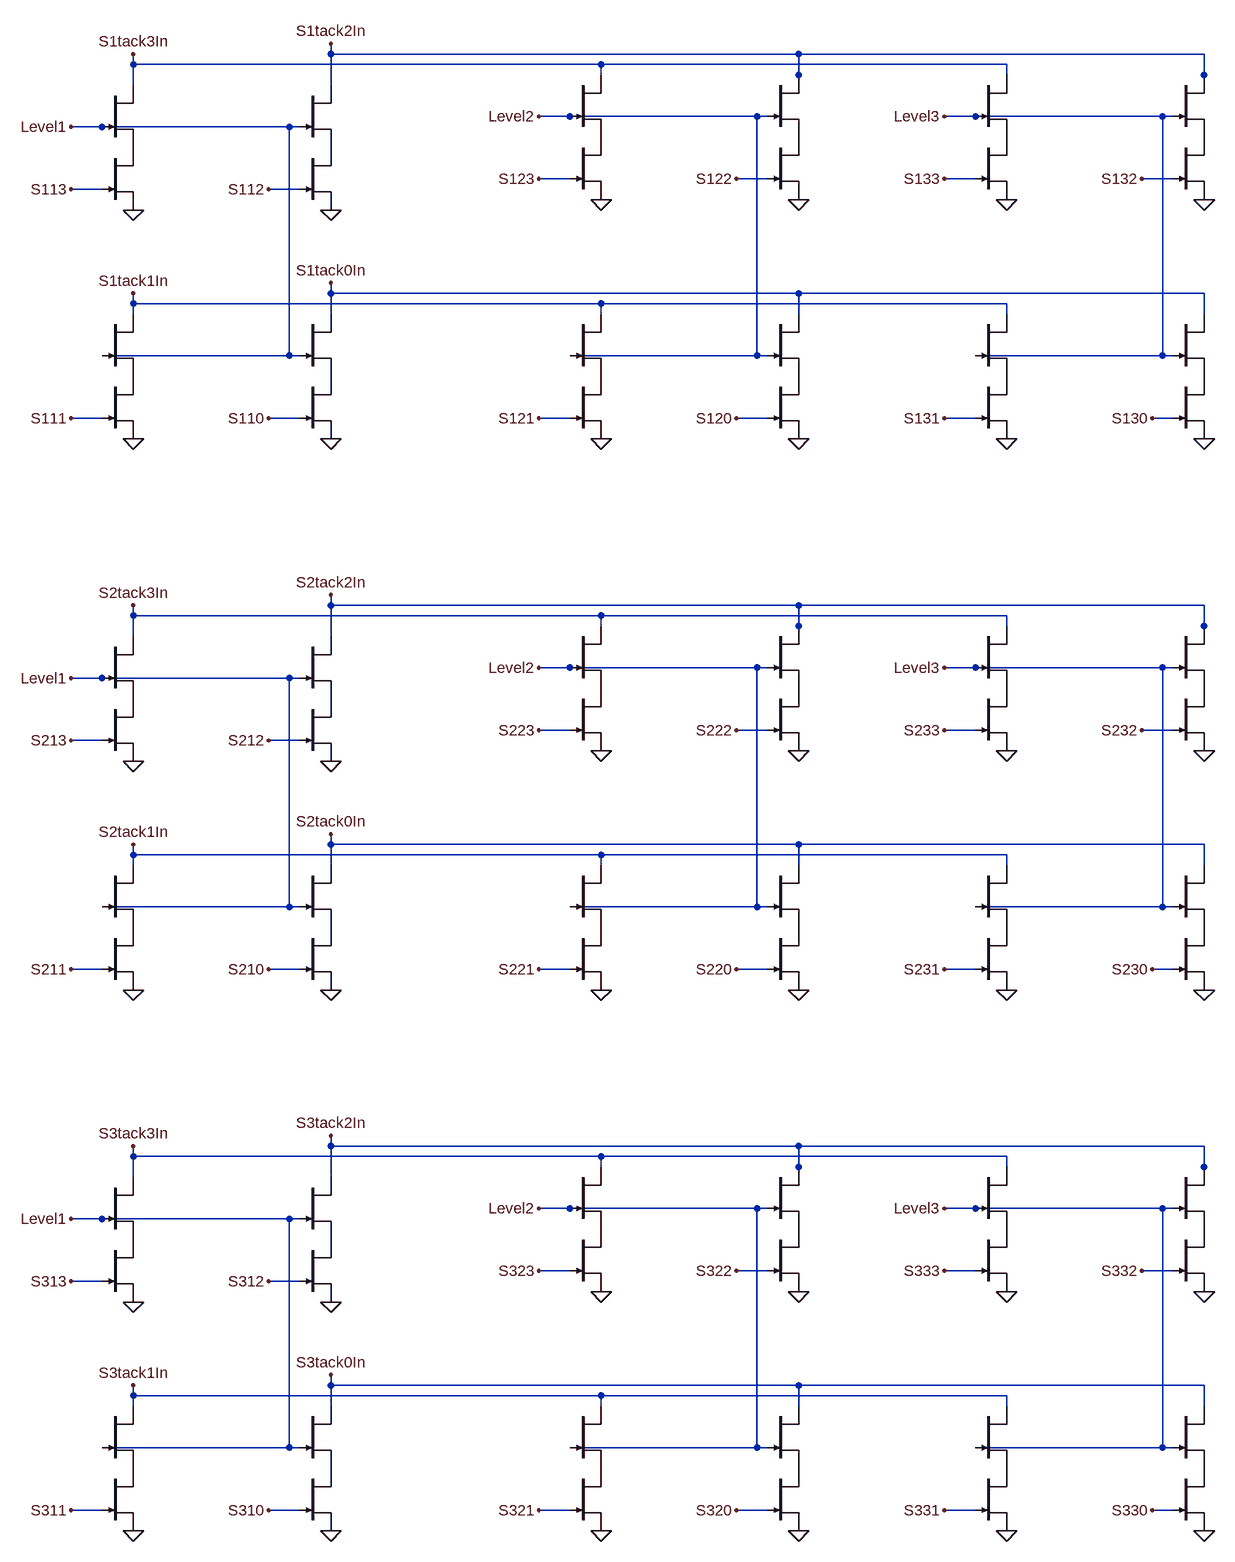
[diagram p0: schematic Bus.asc]
Bus.asc, the LTspice schematic file:
Version 4.1
SHEET 1 109444 42780
WIRE 32592 4992 32592 4976
WIRE 33312 4992 32592 4992
WIRE 33936 4992 33312 4992
WIRE 32288 5008 32288 4992
WIRE 33008 5008 32288 5008
WIRE 33632 5008 33008 5008
WIRE 33008 5024 33008 5008
WIRE 33312 5024 33312 4992
WIRE 33632 5024 33632 5008
WIRE 33936 5024 33936 4992
WIRE 32288 5040 32288 5008
WIRE 32592 5040 32592 4992
WIRE 33312 5040 33312 5024
WIRE 33936 5040 33936 5024
WIRE 32960 5088 32912 5088
WIRE 33248 5088 32960 5088
WIRE 33264 5088 33248 5088
WIRE 33584 5088 33536 5088
WIRE 33872 5088 33584 5088
WIRE 33888 5088 33872 5088
WIRE 32240 5104 32192 5104
WIRE 32528 5104 32240 5104
WIRE 32544 5104 32528 5104
WIRE 32960 5184 32912 5184
WIRE 33264 5184 33216 5184
WIRE 33584 5184 33536 5184
WIRE 33888 5184 33840 5184
WIRE 32240 5200 32192 5200
WIRE 32544 5200 32496 5200
WIRE 32592 5360 32592 5344
WIRE 33312 5360 32592 5360
WIRE 33936 5360 33312 5360
WIRE 32288 5376 32288 5360
WIRE 33008 5376 32288 5376
WIRE 33632 5376 33008 5376
WIRE 32288 5392 32288 5376
WIRE 32592 5392 32592 5360
WIRE 33008 5392 33008 5376
WIRE 33312 5392 33312 5360
WIRE 33632 5392 33632 5376
WIRE 33936 5392 33936 5360
WIRE 32528 5456 32528 5104
WIRE 32528 5456 32240 5456
WIRE 32544 5456 32528 5456
WIRE 33248 5456 33248 5088
WIRE 33248 5456 32960 5456
WIRE 33264 5456 33248 5456
WIRE 33872 5456 33872 5088
WIRE 33872 5456 33584 5456
WIRE 33888 5456 33872 5456
WIRE 32240 5552 32192 5552
WIRE 32544 5552 32496 5552
WIRE 32960 5552 32912 5552
WIRE 33264 5552 33216 5552
WIRE 33584 5552 33536 5552
WIRE 33888 5552 33856 5552
WIRE 32592 5840 32592 5824
WIRE 33312 5840 32592 5840
WIRE 33936 5840 33312 5840
WIRE 32288 5856 32288 5840
WIRE 33008 5856 32288 5856
WIRE 33632 5856 33008 5856
WIRE 33008 5872 33008 5856
WIRE 33312 5872 33312 5840
WIRE 33632 5872 33632 5856
WIRE 33936 5872 33936 5840
WIRE 32288 5888 32288 5856
WIRE 32592 5888 32592 5840
WIRE 33312 5888 33312 5872
WIRE 33936 5888 33936 5872
WIRE 32960 5936 32912 5936
WIRE 33248 5936 32960 5936
WIRE 33264 5936 33248 5936
WIRE 33584 5936 33536 5936
WIRE 33872 5936 33584 5936
WIRE 33888 5936 33872 5936
WIRE 32240 5952 32192 5952
WIRE 32528 5952 32240 5952
WIRE 32544 5952 32528 5952
WIRE 32960 6032 32912 6032
WIRE 33264 6032 33216 6032
WIRE 33584 6032 33536 6032
WIRE 33888 6032 33840 6032
WIRE 32240 6048 32192 6048
WIRE 32544 6048 32496 6048
WIRE 32592 6208 32592 6192
WIRE 33312 6208 32592 6208
WIRE 33936 6208 33312 6208
WIRE 32288 6224 32288 6208
WIRE 33008 6224 32288 6224
WIRE 33632 6224 33008 6224
WIRE 32288 6240 32288 6224
WIRE 32592 6240 32592 6208
WIRE 33008 6240 33008 6224
WIRE 33312 6240 33312 6208
WIRE 33632 6240 33632 6224
WIRE 33936 6240 33936 6208
WIRE 32528 6304 32528 5952
WIRE 32528 6304 32240 6304
WIRE 32544 6304 32528 6304
WIRE 33248 6304 33248 5936
WIRE 33248 6304 32960 6304
WIRE 33264 6304 33248 6304
WIRE 33872 6304 33872 5936
WIRE 33872 6304 33584 6304
WIRE 33888 6304 33872 6304
WIRE 32240 6400 32192 6400
WIRE 32544 6400 32496 6400
WIRE 32960 6400 32912 6400
WIRE 33264 6400 33216 6400
WIRE 33584 6400 33536 6400
WIRE 33888 6400 33856 6400
WIRE 32592 6672 32592 6656
WIRE 33312 6672 32592 6672
WIRE 33936 6672 33312 6672
WIRE 32288 6688 32288 6672
WIRE 33008 6688 32288 6688
WIRE 33632 6688 33008 6688
WIRE 33008 6704 33008 6688
WIRE 33312 6704 33312 6672
WIRE 33632 6704 33632 6688
WIRE 33936 6704 33936 6672
WIRE 32288 6720 32288 6688
WIRE 32592 6720 32592 6672
WIRE 33312 6720 33312 6704
WIRE 33936 6720 33936 6704
WIRE 32960 6768 32912 6768
WIRE 33248 6768 32960 6768
WIRE 33264 6768 33248 6768
WIRE 33584 6768 33536 6768
WIRE 33872 6768 33584 6768
WIRE 33888 6768 33872 6768
WIRE 32240 6784 32192 6784
WIRE 32528 6784 32240 6784
WIRE 32544 6784 32528 6784
WIRE 32960 6864 32912 6864
WIRE 33264 6864 33216 6864
WIRE 33584 6864 33536 6864
WIRE 33888 6864 33840 6864
WIRE 32240 6880 32192 6880
WIRE 32544 6880 32496 6880
WIRE 32592 7040 32592 7024
WIRE 33312 7040 32592 7040
WIRE 33936 7040 33312 7040
WIRE 32288 7056 32288 7040
WIRE 33008 7056 32288 7056
WIRE 33632 7056 33008 7056
WIRE 32288 7072 32288 7056
WIRE 32592 7072 32592 7040
WIRE 33008 7072 33008 7056
WIRE 33312 7072 33312 7040
WIRE 33632 7072 33632 7056
WIRE 33936 7072 33936 7040
WIRE 32528 7136 32528 6784
WIRE 32528 7136 32240 7136
WIRE 32544 7136 32528 7136
WIRE 33248 7136 33248 6768
WIRE 33248 7136 32960 7136
WIRE 33264 7136 33248 7136
WIRE 33872 7136 33872 6768
WIRE 33872 7136 33584 7136
WIRE 33888 7136 33872 7136
WIRE 32240 7232 32192 7232
WIRE 32544 7232 32496 7232
WIRE 32960 7232 32912 7232
WIRE 33264 7232 33216 7232
WIRE 33584 7232 33536 7232
WIRE 33888 7232 33856 7232
FLAG 32288 5232 0
FLAG 32192 5104 Level1
FLAG 32592 5232 0
FLAG 32288 5584 0
FLAG 32592 5584 0
FLAG 33008 5216 0
FLAG 32912 5088 Level2
FLAG 33312 5216 0
FLAG 33008 5584 0
FLAG 33312 5584 0
FLAG 33632 5216 0
FLAG 33536 5088 Level3
FLAG 33936 5216 0
FLAG 33632 5584 0
FLAG 33936 5584 0
FLAG 33536 5184 S133
FLAG 33840 5184 S132
FLAG 33536 5552 S131
FLAG 33856 5552 S130
FLAG 32912 5184 S123
FLAG 33216 5184 S122
FLAG 32912 5552 S121
FLAG 33216 5552 S120
FLAG 32192 5200 S113
FLAG 32496 5200 S112
FLAG 32192 5552 S111
FLAG 32496 5552 S110
FLAG 32288 5360 S1tack1In
FLAG 32592 5344 S1tack0In
FLAG 32592 4976 S1tack2In
FLAG 32288 4992 S1tack3In
FLAG 32288 6080 0
FLAG 32192 5952 Level1
FLAG 32592 6080 0
FLAG 32288 6432 0
FLAG 32592 6432 0
FLAG 33008 6064 0
FLAG 32912 5936 Level2
FLAG 33312 6064 0
FLAG 33008 6432 0
FLAG 33312 6432 0
FLAG 33632 6064 0
FLAG 33536 5936 Level3
FLAG 33936 6064 0
FLAG 33632 6432 0
FLAG 33936 6432 0
FLAG 33536 6032 S233
FLAG 33840 6032 S232
FLAG 33536 6400 S231
FLAG 33856 6400 S230
FLAG 32912 6032 S223
FLAG 33216 6032 S222
FLAG 32912 6400 S221
FLAG 33216 6400 S220
FLAG 32192 6048 S213
FLAG 32496 6048 S212
FLAG 32192 6400 S211
FLAG 32496 6400 S210
FLAG 32288 6208 S2tack1In
FLAG 32592 6192 S2tack0In
FLAG 32592 5824 S2tack2In
FLAG 32288 5840 S2tack3In
FLAG 32288 6912 0
FLAG 32192 6784 Level1
FLAG 32592 6912 0
FLAG 32288 7264 0
FLAG 32592 7264 0
FLAG 33008 6896 0
FLAG 32912 6768 Level2
FLAG 33312 6896 0
FLAG 33008 7264 0
FLAG 33312 7264 0
FLAG 33632 6896 0
FLAG 33536 6768 Level3
FLAG 33936 6896 0
FLAG 33632 7264 0
FLAG 33936 7264 0
FLAG 33536 6864 S333
FLAG 33840 6864 S332
FLAG 33536 7232 S331
FLAG 33856 7232 S330
FLAG 32912 6864 S323
FLAG 33216 6864 S322
FLAG 32912 7232 S321
FLAG 33216 7232 S320
FLAG 32192 6880 S313
FLAG 32496 6880 S312
FLAG 32192 7232 S311
FLAG 32496 7232 S310
FLAG 32288 7040 S3tack1In
FLAG 32592 7024 S3tack0In
FLAG 32592 6656 S3tack2In
FLAG 32288 6672 S3tack3In
SYMBOL njf 32240 5136 R0
WINDOW 0 56 32 Invisible 2
WINDOW 3 56 72 Invisible 2
SYMATTR InstName J0
SYMATTR Value DR
SYMBOL njf 32240 5040 R0
WINDOW 0 56 32 Invisible 2
WINDOW 3 56 72 Invisible 2
SYMATTR InstName J1
SYMATTR Value DR
SYMBOL njf 32544 5136 R0
WINDOW 0 56 32 Invisible 2
WINDOW 3 56 72 Invisible 2
SYMATTR InstName J2
SYMATTR Value DR
SYMBOL njf 32544 5040 R0
WINDOW 0 56 32 Invisible 2
WINDOW 3 56 72 Invisible 2
SYMATTR InstName J3
SYMATTR Value DR
SYMBOL njf 32240 5488 R0
WINDOW 0 56 32 Invisible 2
WINDOW 3 56 72 Invisible 2
SYMATTR InstName J4
SYMATTR Value DR
SYMBOL njf 32240 5392 R0
WINDOW 0 56 32 Invisible 2
WINDOW 3 56 72 Invisible 2
SYMATTR InstName J5
SYMATTR Value DR
SYMBOL njf 32544 5488 R0
WINDOW 0 56 32 Invisible 2
WINDOW 3 56 72 Invisible 2
SYMATTR InstName J6
SYMATTR Value DR
SYMBOL njf 32544 5392 R0
WINDOW 0 56 32 Invisible 2
WINDOW 3 56 72 Invisible 2
SYMATTR InstName J7
SYMATTR Value DR
SYMBOL njf 32960 5120 R0
WINDOW 0 56 32 Invisible 2
WINDOW 3 56 72 Invisible 2
SYMATTR InstName J8
SYMATTR Value DR
SYMBOL njf 32960 5024 R0
WINDOW 0 56 32 Invisible 2
WINDOW 3 56 72 Invisible 2
SYMATTR InstName J9
SYMATTR Value DR
SYMBOL njf 33264 5120 R0
WINDOW 0 56 32 Invisible 2
WINDOW 3 56 72 Invisible 2
SYMATTR InstName J10
SYMATTR Value DR
SYMBOL njf 33264 5024 R0
WINDOW 0 56 32 Invisible 2
WINDOW 3 56 72 Invisible 2
SYMATTR InstName J11
SYMATTR Value DR
SYMBOL njf 32960 5488 R0
WINDOW 0 56 32 Invisible 2
WINDOW 3 56 72 Invisible 2
SYMATTR InstName J12
SYMATTR Value DR
SYMBOL njf 32960 5392 R0
WINDOW 0 56 32 Invisible 2
WINDOW 3 56 72 Invisible 2
SYMATTR InstName J13
SYMATTR Value DR
SYMBOL njf 33264 5488 R0
WINDOW 0 56 32 Invisible 2
WINDOW 3 56 72 Invisible 2
SYMATTR InstName J14
SYMATTR Value DR
SYMBOL njf 33264 5392 R0
WINDOW 0 56 32 Invisible 2
WINDOW 3 56 72 Invisible 2
SYMATTR InstName J15
SYMATTR Value DR
SYMBOL njf 33584 5120 R0
WINDOW 0 56 32 Invisible 2
WINDOW 3 56 72 Invisible 2
SYMATTR InstName J16
SYMATTR Value DR
SYMBOL njf 33584 5024 R0
WINDOW 0 56 32 Invisible 2
WINDOW 3 56 72 Invisible 2
SYMATTR InstName J17
SYMATTR Value DR
SYMBOL njf 33888 5120 R0
WINDOW 0 56 32 Invisible 2
WINDOW 3 56 72 Invisible 2
SYMATTR InstName J18
SYMATTR Value DR
SYMBOL njf 33888 5024 R0
WINDOW 0 56 32 Invisible 2
WINDOW 3 56 72 Invisible 2
SYMATTR InstName J19
SYMATTR Value DR
SYMBOL njf 33584 5488 R0
WINDOW 0 56 32 Invisible 2
WINDOW 3 56 72 Invisible 2
SYMATTR InstName J20
SYMATTR Value DR
SYMBOL njf 33584 5392 R0
WINDOW 0 56 32 Invisible 2
WINDOW 3 56 72 Invisible 2
SYMATTR InstName J21
SYMATTR Value DR
SYMBOL njf 33888 5488 R0
WINDOW 0 56 32 Invisible 2
WINDOW 3 56 72 Invisible 2
SYMATTR InstName J22
SYMATTR Value DR
SYMBOL njf 33888 5392 R0
WINDOW 0 56 32 Invisible 2
WINDOW 3 56 72 Invisible 2
SYMATTR InstName J23
SYMATTR Value DR
SYMBOL njf 32240 5984 R0
WINDOW 0 56 32 Invisible 2
WINDOW 3 56 72 Invisible 2
SYMATTR InstName J24
SYMATTR Value DR
SYMBOL njf 32240 5888 R0
WINDOW 0 56 32 Invisible 2
WINDOW 3 56 72 Invisible 2
SYMATTR InstName J25
SYMATTR Value DR
SYMBOL njf 32544 5984 R0
WINDOW 0 56 32 Invisible 2
WINDOW 3 56 72 Invisible 2
SYMATTR InstName J26
SYMATTR Value DR
SYMBOL njf 32544 5888 R0
WINDOW 0 56 32 Invisible 2
WINDOW 3 56 72 Invisible 2
SYMATTR InstName J27
SYMATTR Value DR
SYMBOL njf 32240 6336 R0
WINDOW 0 56 32 Invisible 2
WINDOW 3 56 72 Invisible 2
SYMATTR InstName J28
SYMATTR Value DR
SYMBOL njf 32240 6240 R0
WINDOW 0 56 32 Invisible 2
WINDOW 3 56 72 Invisible 2
SYMATTR InstName J29
SYMATTR Value DR
SYMBOL njf 32544 6336 R0
WINDOW 0 56 32 Invisible 2
WINDOW 3 56 72 Invisible 2
SYMATTR InstName J30
SYMATTR Value DR
SYMBOL njf 32544 6240 R0
WINDOW 0 56 32 Invisible 2
WINDOW 3 56 72 Invisible 2
SYMATTR InstName J31
SYMATTR Value DR
SYMBOL njf 32960 5968 R0
WINDOW 0 56 32 Invisible 2
WINDOW 3 56 72 Invisible 2
SYMATTR InstName J32
SYMATTR Value DR
SYMBOL njf 32960 5872 R0
WINDOW 0 56 32 Invisible 2
WINDOW 3 56 72 Invisible 2
SYMATTR InstName J33
SYMATTR Value DR
SYMBOL njf 33264 5968 R0
WINDOW 0 56 32 Invisible 2
WINDOW 3 56 72 Invisible 2
SYMATTR InstName J34
SYMATTR Value DR
SYMBOL njf 33264 5872 R0
WINDOW 0 56 32 Invisible 2
WINDOW 3 56 72 Invisible 2
SYMATTR InstName J35
SYMATTR Value DR
SYMBOL njf 32960 6336 R0
WINDOW 0 56 32 Invisible 2
WINDOW 3 56 72 Invisible 2
SYMATTR InstName J36
SYMATTR Value DR
SYMBOL njf 32960 6240 R0
WINDOW 0 56 32 Invisible 2
WINDOW 3 56 72 Invisible 2
SYMATTR InstName J37
SYMATTR Value DR
SYMBOL njf 33264 6336 R0
WINDOW 0 56 32 Invisible 2
WINDOW 3 56 72 Invisible 2
SYMATTR InstName J38
SYMATTR Value DR
SYMBOL njf 33264 6240 R0
WINDOW 0 56 32 Invisible 2
WINDOW 3 56 72 Invisible 2
SYMATTR InstName J39
SYMATTR Value DR
SYMBOL njf 33584 5968 R0
WINDOW 0 56 32 Invisible 2
WINDOW 3 56 72 Invisible 2
SYMATTR InstName J40
SYMATTR Value DR
SYMBOL njf 33584 5872 R0
WINDOW 0 56 32 Invisible 2
WINDOW 3 56 72 Invisible 2
SYMATTR InstName J41
SYMATTR Value DR
SYMBOL njf 33888 5968 R0
WINDOW 0 56 32 Invisible 2
WINDOW 3 56 72 Invisible 2
SYMATTR InstName J42
SYMATTR Value DR
SYMBOL njf 33888 5872 R0
WINDOW 0 56 32 Invisible 2
WINDOW 3 56 72 Invisible 2
SYMATTR InstName J43
SYMATTR Value DR
SYMBOL njf 33584 6336 R0
WINDOW 0 56 32 Invisible 2
WINDOW 3 56 72 Invisible 2
SYMATTR InstName J44
SYMATTR Value DR
SYMBOL njf 33584 6240 R0
WINDOW 0 56 32 Invisible 2
WINDOW 3 56 72 Invisible 2
SYMATTR InstName J45
SYMATTR Value DR
SYMBOL njf 33888 6336 R0
WINDOW 0 56 32 Invisible 2
WINDOW 3 56 72 Invisible 2
SYMATTR InstName J46
SYMATTR Value DR
SYMBOL njf 33888 6240 R0
WINDOW 0 56 32 Invisible 2
WINDOW 3 56 72 Invisible 2
SYMATTR InstName J47
SYMATTR Value DR
SYMBOL njf 32240 6816 R0
WINDOW 0 56 32 Invisible 2
WINDOW 3 56 72 Invisible 2
SYMATTR InstName J48
SYMATTR Value DR
SYMBOL njf 32240 6720 R0
WINDOW 0 56 32 Invisible 2
WINDOW 3 56 72 Invisible 2
SYMATTR InstName J49
SYMATTR Value DR
SYMBOL njf 32544 6816 R0
WINDOW 0 56 32 Invisible 2
WINDOW 3 56 72 Invisible 2
SYMATTR InstName J50
SYMATTR Value DR
SYMBOL njf 32544 6720 R0
WINDOW 0 56 32 Invisible 2
WINDOW 3 56 72 Invisible 2
SYMATTR InstName J51
SYMATTR Value DR
SYMBOL njf 32240 7168 R0
WINDOW 0 56 32 Invisible 2
WINDOW 3 56 72 Invisible 2
SYMATTR InstName J52
SYMATTR Value DR
SYMBOL njf 32240 7072 R0
WINDOW 0 56 32 Invisible 2
WINDOW 3 56 72 Invisible 2
SYMATTR InstName J53
SYMATTR Value DR
SYMBOL njf 32544 7168 R0
WINDOW 0 56 32 Invisible 2
WINDOW 3 56 72 Invisible 2
SYMATTR InstName J54
SYMATTR Value DR
SYMBOL njf 32544 7072 R0
WINDOW 0 56 32 Invisible 2
WINDOW 3 56 72 Invisible 2
SYMATTR InstName J55
SYMATTR Value DR
SYMBOL njf 32960 6800 R0
WINDOW 0 56 32 Invisible 2
WINDOW 3 56 72 Invisible 2
SYMATTR InstName J56
SYMATTR Value DR
SYMBOL njf 32960 6704 R0
WINDOW 0 56 32 Invisible 2
WINDOW 3 56 72 Invisible 2
SYMATTR InstName J57
SYMATTR Value DR
SYMBOL njf 33264 6800 R0
WINDOW 0 56 32 Invisible 2
WINDOW 3 56 72 Invisible 2
SYMATTR InstName J58
SYMATTR Value DR
SYMBOL njf 33264 6704 R0
WINDOW 0 56 32 Invisible 2
WINDOW 3 56 72 Invisible 2
SYMATTR InstName J59
SYMATTR Value DR
SYMBOL njf 32960 7168 R0
WINDOW 0 56 32 Invisible 2
WINDOW 3 56 72 Invisible 2
SYMATTR InstName J60
SYMATTR Value DR
SYMBOL njf 32960 7072 R0
WINDOW 0 56 32 Invisible 2
WINDOW 3 56 72 Invisible 2
SYMATTR InstName J61
SYMATTR Value DR
SYMBOL njf 33264 7168 R0
WINDOW 0 56 32 Invisible 2
WINDOW 3 56 72 Invisible 2
SYMATTR InstName J62
SYMATTR Value DR
SYMBOL njf 33264 7072 R0
WINDOW 0 56 32 Invisible 2
WINDOW 3 56 72 Invisible 2
SYMATTR InstName J63
SYMATTR Value DR
SYMBOL njf 33584 6800 R0
WINDOW 0 56 32 Invisible 2
WINDOW 3 56 72 Invisible 2
SYMATTR InstName J64
SYMATTR Value DR
SYMBOL njf 33584 6704 R0
WINDOW 0 56 32 Invisible 2
WINDOW 3 56 72 Invisible 2
SYMATTR InstName J65
SYMATTR Value DR
SYMBOL njf 33888 6800 R0
WINDOW 0 56 32 Invisible 2
WINDOW 3 56 72 Invisible 2
SYMATTR InstName J66
SYMATTR Value DR
SYMBOL njf 33888 6704 R0
WINDOW 0 56 32 Invisible 2
WINDOW 3 56 72 Invisible 2
SYMATTR InstName J67
SYMATTR Value DR
SYMBOL njf 33584 7168 R0
WINDOW 0 56 32 Invisible 2
WINDOW 3 56 72 Invisible 2
SYMATTR InstName J68
SYMATTR Value DR
SYMBOL njf 33584 7072 R0
WINDOW 0 56 32 Invisible 2
WINDOW 3 56 72 Invisible 2
SYMATTR InstName J69
SYMATTR Value DR
SYMBOL njf 33888 7168 R0
WINDOW 0 56 32 Invisible 2
WINDOW 3 56 72 Invisible 2
SYMATTR InstName J70
SYMATTR Value DR
SYMBOL njf 33888 7072 R0
WINDOW 0 56 32 Invisible 2
WINDOW 3 56 72 Invisible 2
SYMATTR InstName J71
SYMATTR Value DR

The netlist it stands for:
* Bus.asc
J0 P001 S113 0 DR
J1 S1tack3In Level1 P001 DR
J2 P002 S112 0 DR
J3 S1tack2In Level1 P002 DR
J4 P003 S111 0 DR
J5 S1tack1In Level1 P003 DR
J6 P004 S110 0 DR
J7 S1tack0In Level1 P004 DR
J8 P005 S123 0 DR
J9 S1tack3In Level2 P005 DR
J10 P006 S122 0 DR
J11 S1tack2In Level2 P006 DR
J12 P007 S121 0 DR
J13 S1tack1In Level2 P007 DR
J14 P008 S120 0 DR
J15 S1tack0In Level2 P008 DR
J16 P009 S133 0 DR
J17 S1tack3In Level3 P009 DR
J18 P010 S132 0 DR
J19 S1tack2In Level3 P010 DR
J20 P011 S131 0 DR
J21 S1tack1In Level3 P011 DR
J22 P012 S130 0 DR
J23 S1tack0In Level3 P012 DR
J24 P013 S213 0 DR
J25 S2tack3In Level1 P013 DR
J26 P014 S212 0 DR
J27 S2tack2In Level1 P014 DR
J28 P015 S211 0 DR
J29 S2tack1In Level1 P015 DR
J30 P016 S210 0 DR
J31 S2tack0In Level1 P016 DR
J32 P017 S223 0 DR
J33 S2tack3In Level2 P017 DR
J34 P018 S222 0 DR
J35 S2tack2In Level2 P018 DR
J36 P019 S221 0 DR
J37 S2tack1In Level2 P019 DR
J38 P020 S220 0 DR
J39 S2tack0In Level2 P020 DR
J40 P021 S233 0 DR
J41 S2tack3In Level3 P021 DR
J42 P022 S232 0 DR
J43 S2tack2In Level3 P022 DR
J44 P023 S231 0 DR
J45 S2tack1In Level3 P023 DR
J46 P024 S230 0 DR
J47 S2tack0In Level3 P024 DR
J48 P025 S313 0 DR
J49 S3tack3In Level1 P025 DR
J50 P026 S312 0 DR
J51 S3tack2In Level1 P026 DR
J52 P027 S311 0 DR
J53 S3tack1In Level1 P027 DR
J54 P028 S310 0 DR
J55 S3tack0In Level1 P028 DR
J56 P029 S323 0 DR
J57 S3tack3In Level2 P029 DR
J58 P030 S322 0 DR
J59 S3tack2In Level2 P030 DR
J60 P031 S321 0 DR
J61 S3tack1In Level2 P031 DR
J62 P032 S320 0 DR
J63 S3tack0In Level2 P032 DR
J64 P033 S333 0 DR
J65 S3tack3In Level3 P033 DR
J66 P034 S332 0 DR
J67 S3tack2In Level3 P034 DR
J68 P035 S331 0 DR
J69 S3tack1In Level3 P035 DR
J70 P036 S330 0 DR
J71 S3tack0In Level3 P036 DR
.model NJF NJF
.model PJF PJF
.lib standard.jft
.backanno
.end